# Altium project Mustard.PrjPcb
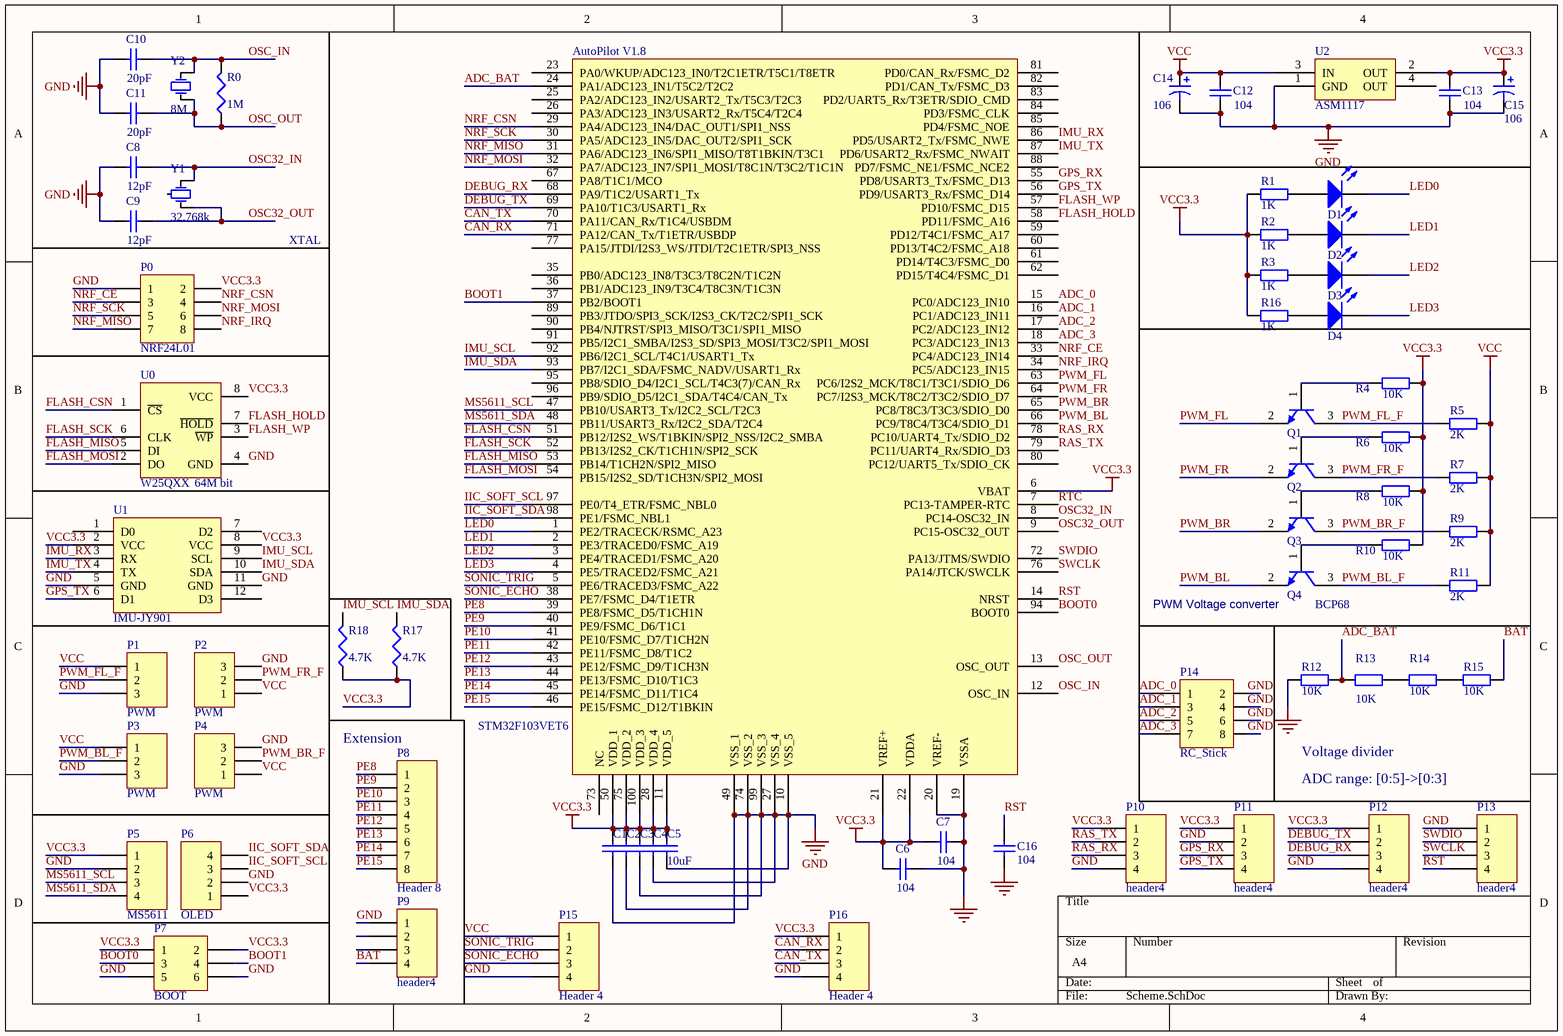
[diagram p0: Scheme.SchDoc]
1 sheet, 66 parts. Net scope: global (net labels, ports and power ports of the same name join across sheets).
Board file: PCB.PcbDoc

## Sheet Scheme.SchDoc
size A4

### Parts
AutoPilot_V1.8  STM32F103VET6  [LQFP-100_M]
C1  Cap Semi  [1608[0603]]  (value not drawn)
C2  Cap Semi  [1608[0603]]  (value not drawn)
C3  Cap Semi  [1608[0603]]  (value not drawn)
C4  Cap Semi  [1608[0603]]  (value not drawn)
C5  value 10uF  [1608[0603]]  (hidden comment: Cap Semi)
C6  value 104  [1608[0603]]  (hidden comment: Cap Semi)
C7  value 104  [1608[0603]]  (hidden comment: Cap Semi)
C8  value 12pF  [1608[0603]]  (hidden comment: Cap Semi)
C9  value 12pF  [1608[0603]]  (hidden comment: Cap Semi)
C10  value 20pF  [1608[0603]]  (hidden comment: Cap Semi)
C11  value 20pF  [1608[0603]]  (hidden comment: Cap Semi)
C12  value 104  [1608[0603]]  (hidden comment: Cap Semi)
C13  value 104  [1608[0603]]  (hidden comment: Cap Semi)
C14  value 106  [1812]  (hidden comment: Cap Pol3)
C15  value 106  [1812]  (hidden comment: Cap Pol3)
C16  value 104  [1608[0603]]  (hidden comment: Cap Semi)
D1  LED0  [LED_0805]  (value not drawn)
D2  LED0  [LED_0805]  (value not drawn)
D3  LED0  [LED_0805]  (value not drawn)
D4  LED0  [LED_0805]  (value not drawn)
P0  NRF24L01  [HDR2X4]
P1  PWM  [HDR1X3]
P2  PWM  [HDR1X3]
P3  PWM  [HDR1X3]
P4  PWM  [HDR1X3]
P5  MS5611  [HDR1X4]
P6  OLED  [HDR1X4]
P7  BOOT  [HDR2X3]
P8  Header 8  [HDR1X8]
P9  header4  [HDR1X4]
P10  header4  [HDR1X4]
P11  header4  [HDR1X4]
P12  header4  [HDR1X4]
P13  header4  [HDR1X4]
P14  RC_Stick  [HDR2X4]
P15  Header 4  [HDR1X4]
P16  Header 4  [HDR1X4]
Q1  BCP68  [SOT-23]  (value not drawn)
Q2  BCP68  [SOT-23]  (value not drawn)
Q3  BCP68  [SOT-23]  (value not drawn)
Q4  BCP68  [SOT-23]
R0  value 1M  [0603-1]  (hidden comment: Res3)
R1  value 1K  [0603-1]  (hidden comment: Res1)
R2  value 1K  [0603-1]  (hidden comment: Res1)
R3  value 1K  [0603-1]  (hidden comment: Res1)
R4  value 10K  [0603-1]  (hidden comment: Res1)
R5  value 2K  [0603-1]  (hidden comment: Res1)
R6  value 10K  [0603-1]  (hidden comment: Res1)
R7  value 2K  [0603-1]  (hidden comment: Res1)
R8  value 10K  [0603-1]  (hidden comment: Res1)
R9  value 2K  [0603-1]  (hidden comment: Res1)
R10  value 10K  [0603-1]  (hidden comment: Res1)
R11  value 2K  [0603-1]  (hidden comment: Res1)
R12  value 10K  [0603-1]  (hidden comment: Res1)
R13  10K  [0603-1]
R14  value 10K  [0603-1]  (hidden comment: Res1)
R15  value 10K  [0603-1]  (hidden comment: Res1)
R16  value 1K  [0603-1]  (hidden comment: Res1)
R17  4.7K  [14-1210]
R18  4.7K  [14-1210]
U0  W25QXX  Memory: 64M bit  [SOIC8_W]
U1  IMU-JY901  [JY-901]
U2  ASM1117  [SOT-223]
Y1  value 32.768k  [X-2X6C - duplicate]  (hidden comment: XTAL_SM)
Y2  value 8M  [X-HC49U]  (hidden comment: XTAL)

### Nets
GND: AutoPilot_V1.8.10(VSS_5) AutoPilot_V1.8.19(VSSA) AutoPilot_V1.8.20(VREF-) AutoPilot_V1.8.27(VSS_4) AutoPilot_V1.8.49(VSS_1) AutoPilot_V1.8.74(VSS_2) AutoPilot_V1.8.99(VSS_3) C1.1 C2.1 C3.1 C4.1 C5.1 C6.2 C7.2 C8.1 C9.1 C10.1 C11.1 C12.1 C13.1 C14.2 C15.2 C16.2 P0.1 P1.3 P2.3 P3.3 P4.3 P5.2 P6.2 P7.5 P7.6 P9.1 P10.4 P11.2 P12.4 P13.1 P14.2 P14.4 P14.6 P14.8 P15.4 P16.4 R12.1 U0.4(GND) U1.5(GND) U1.11(GND) U2.1(GND)
VCC: C12.2 C14.1 P1.1 P2.1 P3.1 P4.1 P15.1 R5.2 R7.2 R9.2 R11.2 U2.3(IN)
VCC3.3: AutoPilot_V1.8.6(VBAT) AutoPilot_V1.8.11(VDD_5) AutoPilot_V1.8.21(VREF+) AutoPilot_V1.8.22(VDDA) AutoPilot_V1.8.28(VDD_4) AutoPilot_V1.8.50(VDD_1) AutoPilot_V1.8.75(VDD_2) AutoPilot_V1.8.100(VDD_3) C1.2 C2.2 C3.2 C4.2 C5.2 C6.1 C7.1 C13.2 C15.1 P0.2 P5.1 P6.1 P7.1 P7.2 P10.1 P11.1 P12.1 P16.1 R1.1 R2.1 R3.1 R4.2 R6.2 R8.2 R10.2 R16.1 R17.1 R18.1 U0.8(VCC) U1.2(VCC) U1.8(VCC) U2.2(OUT)
ADC_0: AutoPilot_V1.8.15(PC0/ADC123_IN10) P14.1
ADC_1: AutoPilot_V1.8.16(PC1/ADC123_IN11) P14.3
ADC_2: AutoPilot_V1.8.17(PC2/ADC123_IN12) P14.5
ADC_3: AutoPilot_V1.8.18(PC3/ADC123_IN13) P14.7
ADC_BAT: AutoPilot_V1.8.24(PA1/ADC123_IN1/T5C2/T2C2) R12.2 R13.1
BAT: P9.4 R15.2
BOOT0: AutoPilot_V1.8.94(BOOT0) P7.3
BOOT1: AutoPilot_V1.8.37(PB2/BOOT1) P7.4
CAN_RX: AutoPilot_V1.8.71(PA12/CAN_Tx/T1ETR/USBDP) P16.2
CAN_TX: AutoPilot_V1.8.70(PA11/CAN_Rx/T1C4/USBDM) P16.3
DEBUG_RX: AutoPilot_V1.8.68(PA9/T1C2/USART1_Tx) P12.3
DEBUG_TX: AutoPilot_V1.8.69(PA10/T1C3/USART1_Rx) P12.2
FLASH_CSN: AutoPilot_V1.8.51(PB12/I2S2_WS/T1BKIN/SPI2_NSS/I2C2_SMBA) U0.1(~{CS})
FLASH_HOLD: AutoPilot_V1.8.58(PD11/FSMC_A16) U0.7(~{HOLD})
FLASH_MISO: AutoPilot_V1.8.53(PB14/T1CH2N/SPI2_MISO) U0.5(DI)
FLASH_MOSI: AutoPilot_V1.8.54(PB15/I2S2_SD/T1CH3N/SPI2_MOSI) U0.2(DO)
FLASH_SCK: AutoPilot_V1.8.52(PB13/I2S2_CK/T1CH1N/SPI2_SCK) U0.6(CLK)
FLASH_WP: AutoPilot_V1.8.57(PD10/FSMC_D15) U0.3(~{WP})
GPS_RX: AutoPilot_V1.8.55(PD8/USART3_Tx/FSMC_D13) P11.3
GPS_TX: AutoPilot_V1.8.56(PD9/USART3_Rx/FSMC_D14) P11.4 U1.6(D1)
IIC_SOFT_SCL: AutoPilot_V1.8.97(PE0/T4_ETR/FSMC_NBL0) P6.3
IIC_SOFT_SDA: AutoPilot_V1.8.98(PE1/FSMC_NBL1) P6.4
IMU_RX: AutoPilot_V1.8.86(PD5/USART2_Tx/FSMC_NWE) U1.3(RX)
IMU_SCL: AutoPilot_V1.8.92(PB6/I2C1_SCL/T4C1/USART1_Tx) R18.2 U1.9(SCL)
IMU_SDA: AutoPilot_V1.8.93(PB7/I2C1_SDA/FSMC_NADV/USART1_Rx) R17.2 U1.10(SDA)
IMU_TX: AutoPilot_V1.8.87(PD6/USART2_Rx/FSMC_NWAIT) U1.4(TX)
LED0: AutoPilot_V1.8.1(PE2/TRACECK/RSMC_A23) D1.2(K)
LED1: AutoPilot_V1.8.2(PE3/TRACED0/FSMC_A19) D2.2(K)
LED2: AutoPilot_V1.8.3(PE4/TRACED1/FSMC_A20) D3.2(K)
LED3: AutoPilot_V1.8.4(PE5/TRACED2/FSMC_A21) D4.2(K)
MS5611_SCL: AutoPilot_V1.8.47(PB10/USART3_Tx/I2C2_SCL/T2C3) P5.3
MS5611_SDA: AutoPilot_V1.8.48(PB11/USART3_Rx/I2C2_SDA/T2C4) P5.4
NRF_CE: AutoPilot_V1.8.33(PC4/ADC123_IN14) P0.3
NRF_CSN: AutoPilot_V1.8.29(PA4/ADC123_IN4/DAC_OUT1/SPI1_NSS) P0.4
NRF_IRQ: AutoPilot_V1.8.34(PC5/ADC123_IN15) P0.8
NRF_MISO: AutoPilot_V1.8.31(PA6/ADC123_IN6/SPI1_MISO/T8T1BKIN/T3C1) P0.7
NRF_MOSI: AutoPilot_V1.8.32(PA7/ADC123_IN7/SPI1_MOSI/T8C1N/T3C2/T1C1N) P0.6
NRF_SCK: AutoPilot_V1.8.30(PA5/ADC123_IN5/DAC_OUT2/SPI1_SCK) P0.5
OSC32_IN: AutoPilot_V1.8.8(PC14-OSC32_IN) C8.2 Y1.1(OSC1)
OSC32_OUT: AutoPilot_V1.8.9(PC15-OSC32_OUT) C9.2 Y1.2(OSC2)
OSC_IN: AutoPilot_V1.8.12(OSC_IN) C10.2 R0.2 Y2.2(OSC2)
OSC_OUT: AutoPilot_V1.8.13(OSC_OUT) C11.2 R0.1 Y2.1(OSC1)
PE8: AutoPilot_V1.8.39(PE8/FSMC_D5/T1CH1N) P8.1
PE9: AutoPilot_V1.8.40(PE9/FSMC_D6/T1C1) P8.2
PE10: AutoPilot_V1.8.41(PE10/FSMC_D7/T1CH2N) P8.3
PE11: AutoPilot_V1.8.42(PE11/FSMC_D8/T1C2) P8.4
PE12: AutoPilot_V1.8.43(PE12/FSMC_D9/T1CH3N) P8.5
PE13: AutoPilot_V1.8.44(PE13/FSMC_D10/T1C3) P8.6
PE14: AutoPilot_V1.8.45(PE14/FSMC_D11/T1C4) P8.7
PE15: AutoPilot_V1.8.46(PE15/FSMC_D12/T1BKIN) P8.8
PWM_BL: AutoPilot_V1.8.66(PC9/T8C4/T3C4/SDIO_D1) Q4.2(E)
PWM_BL_F: P3.2 Q4.3(C) R11.1
PWM_BR: AutoPilot_V1.8.65(PC8/T8C3/T3C3/SDIO_D0) Q3.2(E)
PWM_BR_F: P4.2 Q3.3(C) R9.1
PWM_FL: AutoPilot_V1.8.63(PC6/I2S2_MCK/T8C1/T3C1/SDIO_D6) Q1.2(E)
PWM_FL_F: P1.2 Q1.3(C) R5.1
PWM_FR: AutoPilot_V1.8.64(PC7/I2S3_MCK/T8C2/T3C2/SDIO_D7) Q2.2(E)
PWM_FR_F: P2.2 Q2.3(C) R7.1
RAS_RX: AutoPilot_V1.8.78(PC10/UART4_Tx/SDIO_D2) P10.3
RAS_TX: AutoPilot_V1.8.79(PC11/UART4_Rx/SDIO_D3) P10.2
RST: AutoPilot_V1.8.14(NRST) C16.1 P13.4
RTC: AutoPilot_V1.8.7(PC13-TAMPER-RTC)
SONIC_ECHO: AutoPilot_V1.8.38(PE7/FSMC_D4/T1ETR) P15.3
SONIC_TRIG: AutoPilot_V1.8.5(PE6/TRACED3/FSMC_A22) P15.2
SWCLK: AutoPilot_V1.8.76(PA14/JTCK/SWCLK) P13.3
SWDIO: AutoPilot_V1.8.72(PA13/JTMS/SWDIO) P13.2
NetD1_1: D1.1(A) R1.2
NetD2_1: D2.1(A) R2.2
NetD3_1: D3.1(A) R3.2
NetD4_1: D4.1(A) R16.2
NetQ1_1: Q1.1(B) R4.1
NetQ2_1: Q2.1(B) R6.1
NetQ3_1: Q3.1(B) R8.1
NetQ4_1: Q4.1(B) R10.1
NetR13_2: R13.2 R14.1
NetR14_2: R14.2 R15.1

Not connected (* = marked no-connect by the designer): AutoPilot_V1.8 23(PA0/WKUP/ADC123_IN0/T2C1ETR/T5C1/T8ETR) 25(PA2/ADC123_IN2/USART2_Tx/T5C3/T2C3) 26(PA3/ADC123_IN3/USART2_Rx/T5C4/T2C4) 35(PB0/ADC123_IN8/T3C3/T8C2N/T1C2N) 36(PB1/ADC123_IN9/T3C4/T8C3N/T1C3N) 59(PD12/T4C1/FSMC_A17) 60(PD13/T4C2/FSMC_A18) 61(PD14/T4C3/FSMC_D0) 62(PD15/T4C4/FSMC_D1) 67(PA8/T1C1/MCO) 73(NC) 77(PA15/JTDI/I2S3_WS/JTDI/T2C1ETR/SPI3_NSS) 80(PC12/UART5_Tx/SDIO_CK) 81(PD0/CAN_Rx/FSMC_D2) 82(PD1/CAN_Tx/FSMC_D3) 83(PD2/UART5_Rx/T3ETR/SDIO_CMD) 84(PD3/FSMC_CLK) 85(PD4/FSMC_NOE) 88(PD7/FSMC_NE1/FSMC_NCE2) 89(PB3/JTDO/SPI3_SCK/I2S3_CK/T2C2/SPI1_SCK) 90(PB4/NJTRST/SPI3_MISO/T3C1/SPI1_MISO) 91(PB5/I2C1_SMBA/I2S3_SD/SPI3_MOSI/T3C2/SPI1_MOSI) 95(PB8/SDIO_D4/I2C1_SCL/T4C3(7)/CAN_Rx) 96(PB9/SDIO_D5/I2C1_SDA/T4C4/CAN_Tx); P9 2 3; U1 1(D0) 7(D2) 12(D3); U2 4(OUT); Y1 3

### Notes on the sheet
- XTAL
- (near Q4) PWM Voltage converter
- (near P8) Extension
- Voltage divider
- ADC range: [0:5]->[0:3]

### Library data of the parts
AutoPilot_V1.8 = STM32F103V: STM32单片机100引脚
C1-C4 = Cap Semi: Capacitor (Semiconductor SIM Model); Value: 100pF; Published: 8-Jun-2000; LatestRevisionDate: 29-May-2009; LatestRevisionNote: IPC-7351 Footprint Added.; PackageReference: C1206; Publisher: Altium Limited; PackageDescription: Chip Capacitor
C5-C13 C16 = Cap Semi: Capacitor (Semiconductor SIM Model); Published: 8-Jun-2000; LatestRevisionDate: 29-May-2009; LatestRevisionNote: IPC-7351 Footprint Added.; PackageReference: C1206; Publisher: Altium Limited; PackageDescription: Chip Capacitor
C14 C15 = Cap Pol3: Polarized Capacitor (Surface Mount); Published: 8-Jun-2000; LatestRevisionDate: 29-May-2009; LatestRevisionNote: IPC-7351 Footprint Added.; PackageReference: C0805; Publisher: Altium Limited; PackageDescription: Chip Capacitor
D1-D4 = LED0: 发光二极管; Published: 8-Jun-2000; LatestRevisionDate: 08-Jul-2005; LatestRevisionNote: Mech Layer 1 removed.; PackageReference: LED-0; Publisher: Altium Limited
P0 P14 = Header 4X2: Header, 4-Pin, Dual row; LatestRevisionDate: 17-Jul-2002; LatestRevisionNote: Re-released for DXP Platform.; Publisher: Altium Limited
P1-P4 = Header 3: Header, 3-Pin; LatestRevisionDate: 17-Jul-2002; LatestRevisionNote: Re-released for DXP Platform.; Publisher: Altium Limited
P5 P6 P9-P13 P15 P16 = Header 4: Header, 4-Pin; LatestRevisionDate: 17-Jul-2002; LatestRevisionNote: Re-released for DXP Platform.; Publisher: Altium Limited
P7 = Header 3X2: Header, 3-Pin, Dual row; LatestRevisionDate: 17-Jul-2002; LatestRevisionNote: Re-released for DXP Platform.; Publisher: Altium Limited
P8 = Header 8: Header, 8-Pin; LatestRevisionDate: 17-Jul-2002; LatestRevisionNote: Re-released for DXP Platform.; Publisher: Altium Limited
Q1-Q4 = BCP68: NPN三极管; Published: 17-Sep-2003; LatestRevisionDate: 12-Dec-2006; LatestRevisionNote: IPC-7351 Footprint Added.; DatasheetVersion: 8-Apr-1999; PackageVersion: Aug-2001; PackageReference: SOT223; Publisher: Altium Limited; PackageDescription: 4-Pin SOT-223 Package 2.3 mm Pitch, 7 mm Lead Span; ComponentLink1Description: Manufacturer Link; ComponentLink1URL: http://www.semiconductors.philips.com/; ComponentLink2Description: Datasheet; ComponentLink2URL: http://www.semiconductors.philips.com/acrobat/datasheets/BCP68_4.pdf
R0 R17 R18 = Res3: Resistor; Published: 8-Jun-2000; LatestRevisionDate: 29-May-2009; LatestRevisionNote: IPC-7351 Footprint Added.; PackageReference: J1-0603; Publisher: Altium Limited; PackageDescription: Chip Resistor
  R17 R18: Value: 4.7K
R1-R16 = Res1: 贴片电阻; Published: 8-Jun-2000; LatestRevisionDate: 17-Jul-2002; LatestRevisionNote: Re-released for DXP Platform.; PackageReference: AXIAL-0.4; Publisher: Altium Limited
  R13: Value: 10K
U0 = W25QXX: SPI FLASH
U1 = JY901
U2 = ASM1117: 3.3V稳压芯片
Y1 = XTAL_SM: 圆柱晶振; Published: 8-Jun-2000; LatestRevisionDate: 17-Jul-2002; LatestRevisionNote: Re-released for DXP Platform.; PackageReference: R38; Publisher: Altium Limited
Y2 = XTAL: 晶振; Published: 8-Jun-2000; LatestRevisionDate: 17-Jul-2002; LatestRevisionNote: Re-released for DXP Platform.; PackageReference: R38; Publisher: Altium Limited